# EAGLE design H32R10 (EAGLE 9.2.2)
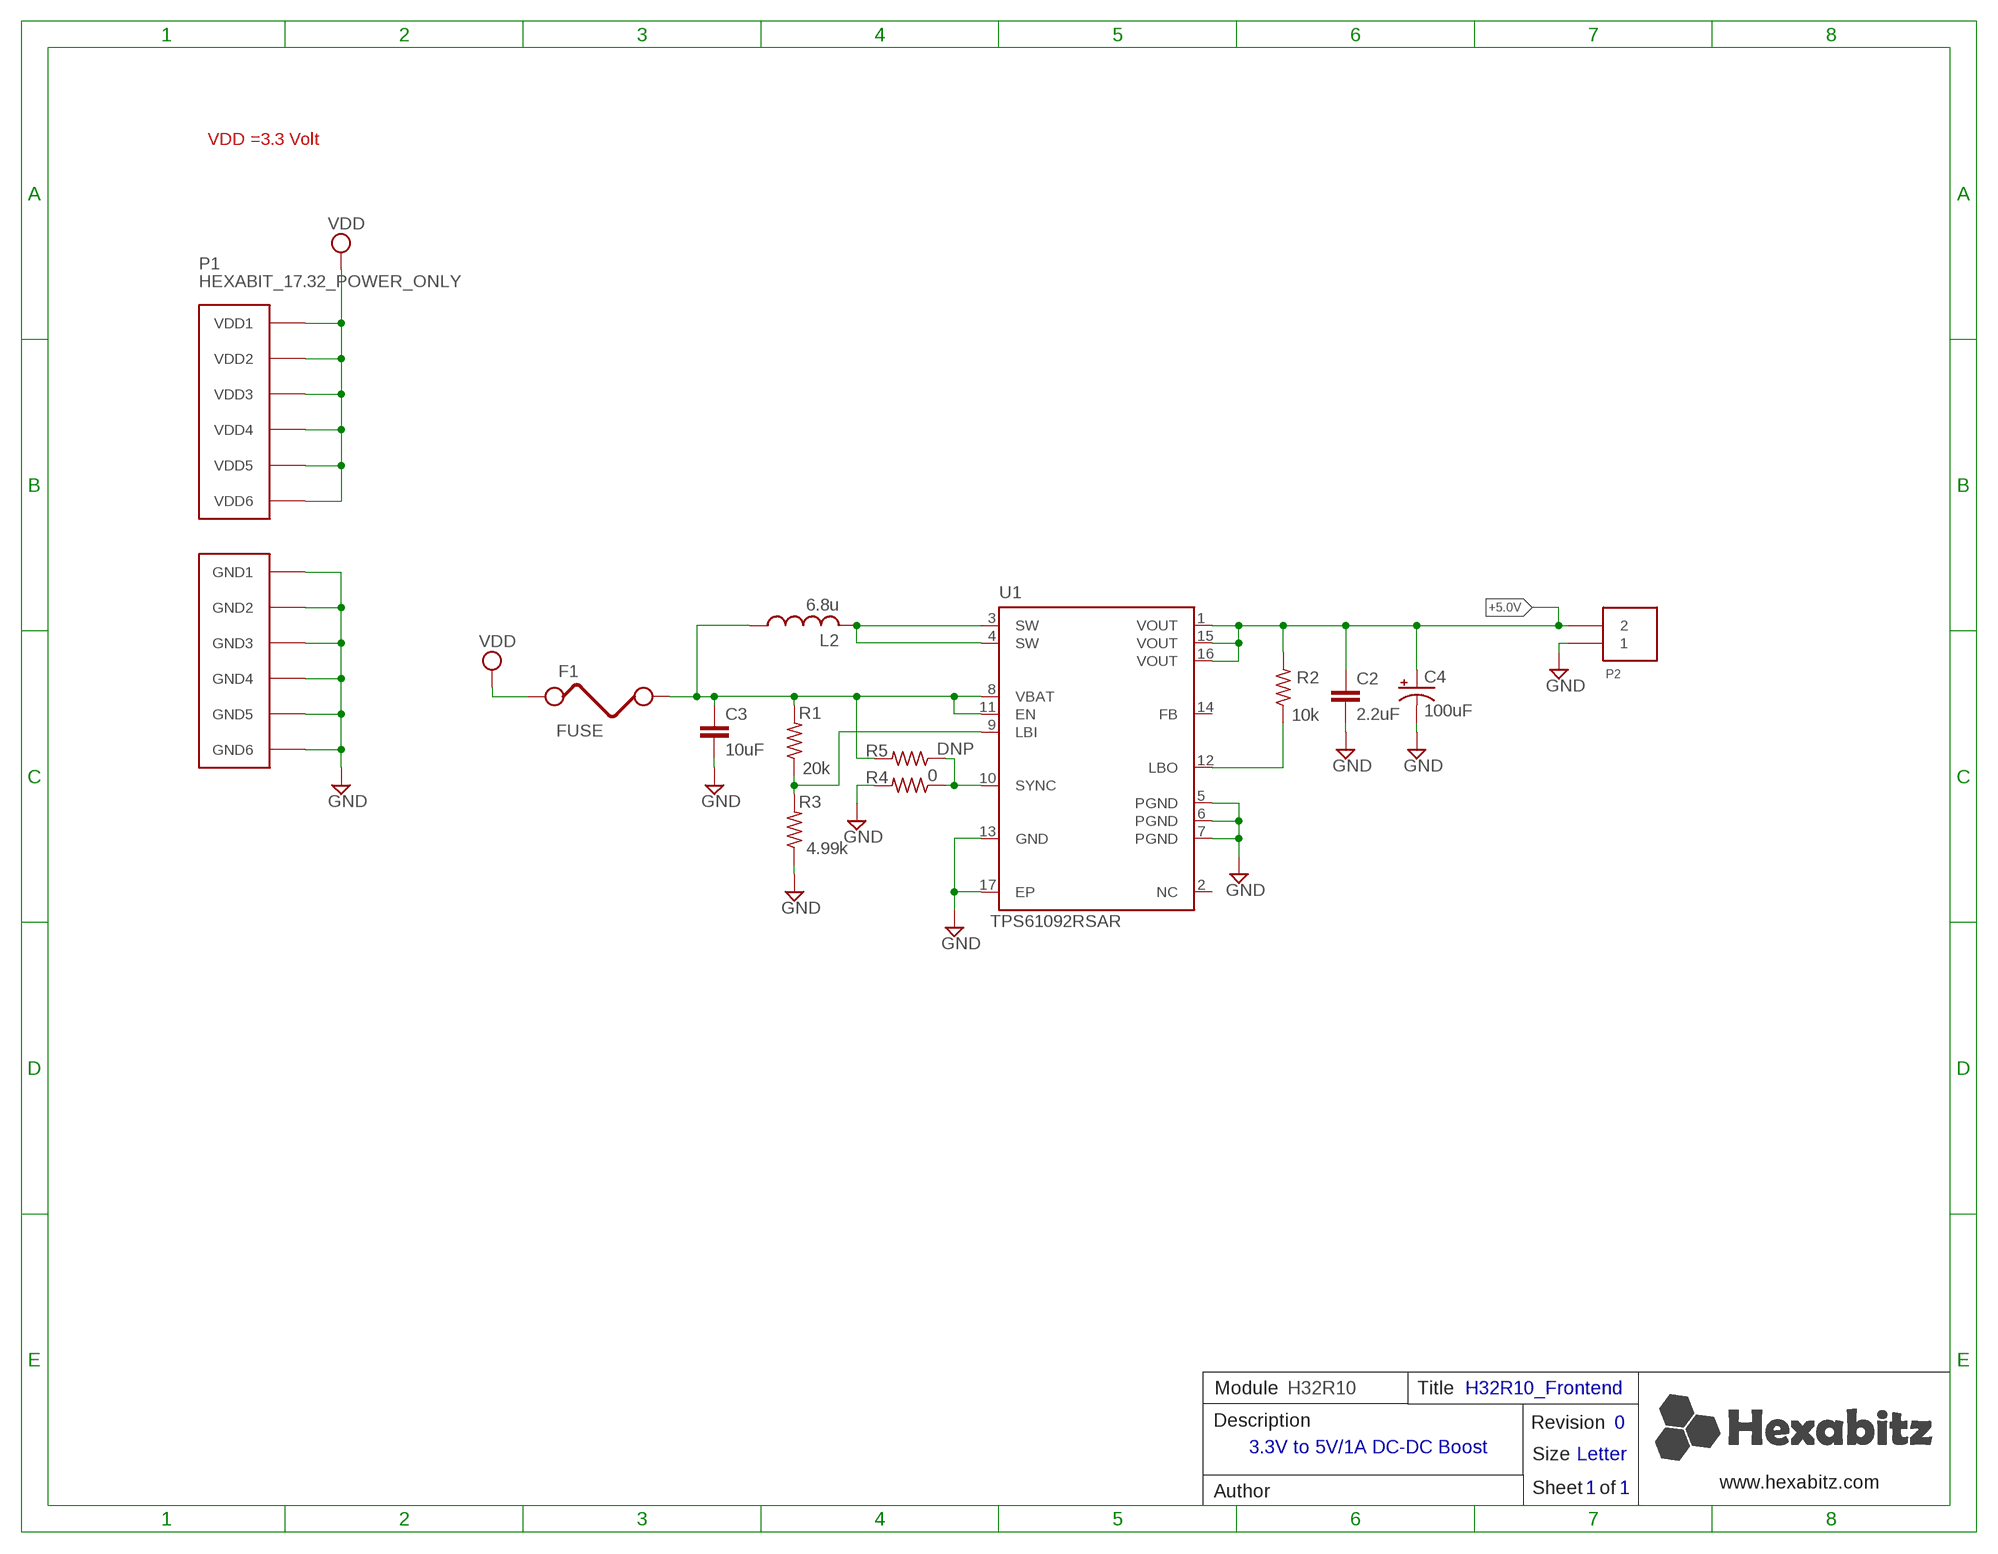
[diagram p0: schematic, sheet 1]

## Parts
C2  2.2uF  C-0603  [C-0603]
C3  10uF  C-0603  [C-0603]
C4  100uF  C-1210-POL  [C-1210-POL]
F1  FUSE  [FUSE]
L2  6.8u  IND-7447789006  [IND-7447789006]
P1  HEXABIT_17.32_POWER_ONLY  [HEXABIT_17.32_POWER_ONLY]
P2  691311500102  [691311500102]
R1  20k  R-0402  [R-0402]
R2  10k  R-0402  [R-0402]
R3  4.99k  R-0402  [R-0402]
R4  0  R-0402  [R-0402]
R5  DNP  R-0402  [R-0402]
U1  TPS61092RSAR  [TPS61092RSAR]

## Nets
+5.0V: C2.1 C4.1(+) P2.2 R2.2 U1.1(VOUT) U1.15(VOUT) U1.16(VOUT)
GND: C2.2 C3.2 C4.2(-) P1.PAD_PD7(GND1) P1.PAD_PD8(GND2) P1.PAD_PD9(GND3) P1.PAD_PD10(GND4) P1.PAD_PD11(GND5) P1.PAD_PD12(GND6) P2.1 R3.1 R4.2 U1.5(PGND) U1.6(PGND) U1.7(PGND) U1.13(GND) U1.17(EP)
N$1: R1.1 R3.2 U1.9(LBI)
N$2: C3.1 F1.2 L2.1 R1.2 R5.2 U1.8(VBAT) U1.11(EN)
N$3: L2.2 U1.3(SW) U1.4(SW)
N$4: R2.1 U1.12(LBO)
N$5: R4.1 R5.1 U1.10(SYNC)
VDD: F1.1 P1.PAD_PU7(VDD1) P1.PAD_PU8(VDD2) P1.PAD_PU9(VDD3) P1.PAD_PU10(VDD4) P1.PAD_PU11(VDD5) P1.PAD_PU12(VDD6)
Unconnected: U1.2(NC) U1.14(FB)

## Notes on the sheet
- VDD =3.3 Volt
- Module | H32R10 | Title | H32R10_Frontend
- Description | Revision | 0
- 3.3V to 5V/1A DC-DC Boost
- Size | Letter
- www.hexabitz.com
- Author | Sheet   of | 1 | 1
- C:/Users/Admin/Desktop/logodraft.bmp

## Library data of the parts
C2 = Hexabitz:C-0603: CAP CER 10% X7R 0603; CAPACITANCE: 2.2uF; MFN: TDK Corporation; MPN: C1608X5R1C225K080AB; OCTOPART_URL: https://octopart.com/search?q=C1608X5R1C225K080AB&start=0; TOLERANCE: ±10%; VOLTAGE_RATING: 16V
C3 = Hexabitz:C-0603: CAP CER 10% X7R 0603; CAPACITANCE: 10uF; MFN: Murata; MPN: GRM188R60J106ME84D; OCTOPART_URL: https://octopart.com/search?r=sp&s=3UultoWHTYKlRdSTI8cSeA&q=GRM188R60J106ME84&start=0; TOLERANCE: ±20%; VOLTAGE_RATING: 6.3V
C4 = Hexabitz:C-1210-POL: Cap Tant Solid SMD 1210; CAPACITANCE: 100uF; MFN: Taiyo Yuden; MPN: LMK325ABJ107MMHT; OCTOPART_URL: https://octopart.com/search?q=LMK325ABJ107MMHT&start=0
F1 = Hexabitz:FUSE: PTC RESET FUSE 16V 2.6A 1812; MFN: Littelfuse Inc.; MPN: MINISMDC260F/16-2; OCTOPART_URL: https://octopart.com/search?r=sp&s=3UultoWHTYKlRdSTI8cSeA&q=MINISMDC260F%2F16-2&start=0
L2 = Hexabitz:IND-7447789006: FIXED IND 6.8UH 2.5A 44 MOHM SMD; MFN: Wurth Electronics Inc.; MPN: 7447789006; OCTOPART_URL: https://octopart.com/search?q=7447789006&start=0
P1 = hexabitz_connectors:HEXABIT_?_POWER_ONLY: Hexabitz Hexagon Module Connector Hexagon side length = 17.32mm. Power-only connector. All array ports are removed.
P2 = Hexabitz:691311500102: Description : Pin header, straight Series WR-TBL / 311 Solder Pin [PCB, Through-Hole] 2P; MFN: 691311500102; MPN: Wurth Electronics Inc.; OCTOPART_URL: https://octopart.com/search?q=691311500102&start=0
R1 = Hexabitz:R-0402: Thick Film Resistors - SMD 0603; MFN: Yageo; MPN: RC0402FR-0720KL; OCTOPART_URL: https://octopart.com/search?q=%09%20RC0402FR-0720KL&start=0; RESISTANCE: 20K; TOLERANCE: 1%
R2 = Hexabitz:R-0402: Thick Film Resistors - SMD 0603; MFN: Yageo; MPN: AT0402FRE0710KL; OCTOPART_URL: https://octopart.com/search?q=AT0402FRE0710KL&start=0; RESISTANCE: 10K; TOLERANCE: 1%
R3 = Hexabitz:R-0402: Thick Film Resistors - SMD 0603; MFN: Yageo; MPN: AC0402FR-074K99L; OCTOPART_URL: https://octopart.com/search?q=AC0402FR-074K99L&start=0; RESISTANCE: 4.99K; TOLERANCE: 1%
R4 = Hexabitz:R-0402: Thick Film Resistors - SMD 0603; MFN: Yageo; MPN: AC0402JR-070RL; OCTOPART_URL: https://octopart.com/search?q=AC0402JR-070RL&start=0; RESISTANCE: 0
R5 = Hexabitz:R-0402: Thick Film Resistors - SMD 0603; MPN: DNP
U1 = Hexabitz:TPS61092RSAR: IC REG BOOST 5V 2A SYNC 16VQFN; MFN: Texas Instruments; MPN: TPS61092RSAR; OCTOPART_URL: https://octopart.com/tps61092rsar-texas+instruments-439857?r=sp&s=ulIrj1fsS3KVIo6pbpFvxA

## Board
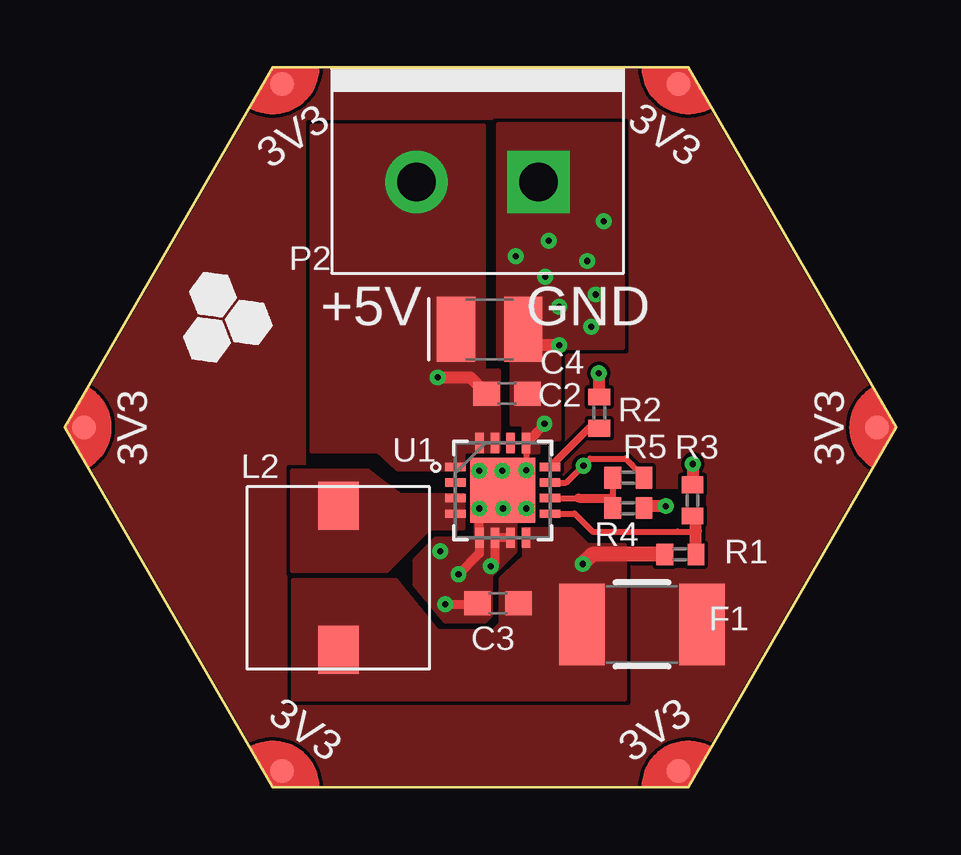
[diagram p1: board, top side]
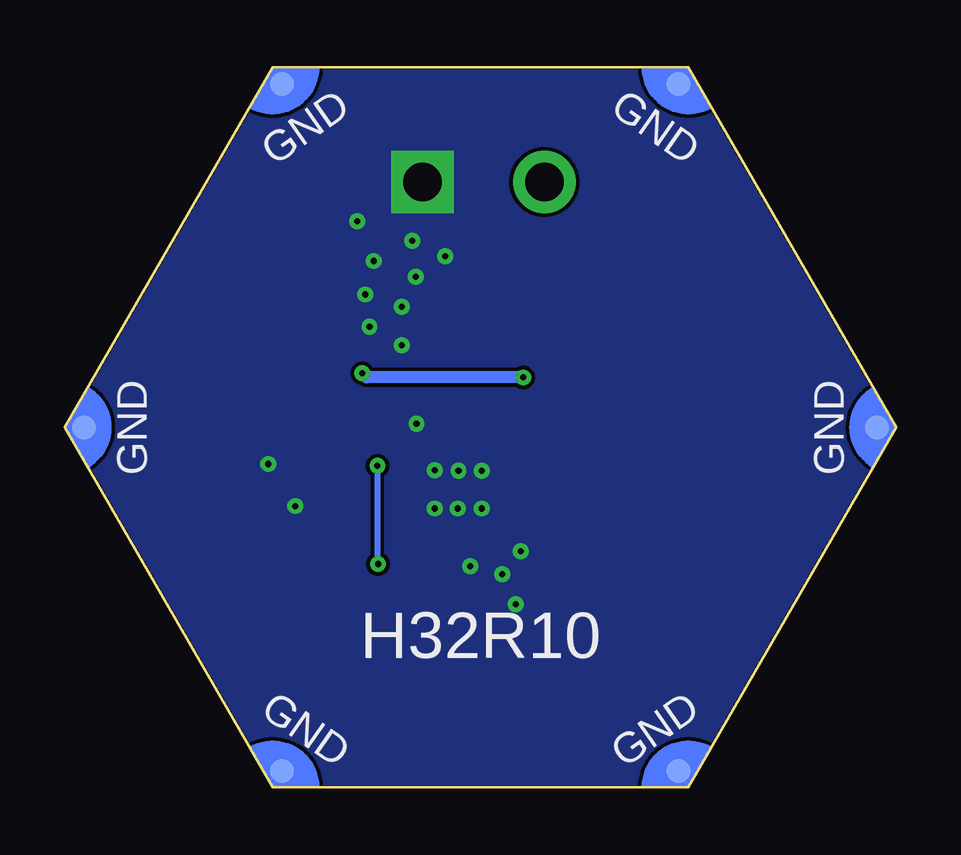
[diagram p2: board, bottom side, seen from below]

Size 34.64 x 30 mm. Coordinates in mm from the lower left corner, seen from the top.
Copper layers (1*16): Top 0.035mm / dielectric 1.5mm / Bottom 0.035mm
Design rules "2_layer *": minimum track width 7mil, minimum drill 10mil, track to track 6mil, track to pad 6mil, pad to pad 6mil, via to via 6mil, smd to smd 0mil, copper to edge 1mil, drill to drill 8mil, minimum pad ring 10mil, minimum via ring 8mil, stop-mask expansion 2mil, vias tented up to drill 15mil, thermal gap 10mil
tRestrict: area 25.2,9.2 to 26,10.1; area 23.1,11 to 24,12.6; area 24.5,11.6 to 26.6,12.4; area 10.1,13.4 to 10.6,13.8; area 17.6,27.2 to 17.9,27.8

### Footprints (pad centres in the part's own frame; a part is rotated, then mirrored left to right if it is on the bottom)
C-0603 = smd 1.1 x 1: 1 -0.85,0; 2 0.85,0
C-1210-POL = smd 1.6 x 2.7: 1 -1.4,0; 2 1.4,0
FUSE = smd 1.9 x 3.4: 1 -2.5,0; 2 2.5,0
IND-7447789006 = smd 1.7 x 2: 1 0,3; 2 0,-3
HEXABIT_17.32_POWER_ONLY = smd 1 x 1 bottom: PAD_PD7 8.26,14.31; PAD_PD8 16.52,0; PAD_PD9 8.26,-14.31; PAD_PD10 -8.26,-14.31; PAD_PD11 -16.52,0; PAD_PD12 -8.26,14.31 | smd 1 x 1: PAD_PU7 8.26,14.31; PAD_PU8 16.52,0; PAD_PU9 8.26,-14.31; PAD_PU10 -8.26,-14.31; PAD_PU11 -16.52,0; PAD_PU12 -8.26,14.31
691311500102 = drill 1.6 pad 2.6 square: 1 -2.54,0 | drill 1.6 pad 2.6: 2 2.54,0
R-0402 = smd 0.7 x 0.9: 1 -0.65,0; 2 0.65,0
TPS61092RSAR = smd 0.85 x 0.35: 1 -1.975,0.975; 2 -1.975,0.325; 3 -1.975,-0.325; 4 -1.975,-0.975; 9 1.975,-0.975; 10 1.975,-0.325; 11 1.975,0.325; 12 1.975,0.975 | smd 0.35 x 0.85: 5 -0.975,-1.975; 6 -0.325,-1.975; 7 0.325,-1.975; 8 0.975,-1.975; 13 0.975,1.975; 14 0.325,1.975; 15 -0.325,1.975; 16 -0.975,1.975 | smd 2.7 x 2.7: 17 0,0

### Placement (x,y rotation side)
C2  18.43,16.4 0 top
C3  18.05,7.68 180 top
C4  17.7,19.08 0 top
F1  24.05,6.79 180 top
L2  11.4,8.73 180 top
P1  17.32,15 0 top
P2  17.2,25.23 180 top
R1  25.65,9.71 180 top
R2  22.27,15.61 90 top
R3  26.16,11.96 270 top
R4  23.48,11.64 0 top
R5  23.48,12.9 0 top
U1  18.25,12.38 0 top

### Tracks (layer width: path | path; a pad name or v marks a point on that pad's centre or on a via)
+5.0V  (via drill 0.25 pad 0.51)
  Top 0.508: 22.1,16.26 R2.2 22.27,17.24 v22.25,17.26 | v15.54,17.08 16.89,17.08 C2.1
  Bottom 0.508: 15.54,17.11 v15.54,17.08 22.07,17.08 v22.25,17.26
  pour Top (no thermals): 13.87,13.25 16.61,13.25 16.61,13.98 16.63,14.01 18.03,14.01 18.08,14.06 18.08,17.36 17.45,17.36 17.45,27.57 10.28,27.57 10.28,14.01 13.05,14.01
GND  (via drill 0.25 pad 0.51)
  Top 0.254: U1.13 | U1.13 v19.22,13.22
  Top 0.381: U1.13 19.62,14.75 v19.99,15.15 | v17.75,9.21 17.92,9.38 U1.6 U1.7 | v16.41,8.88 17.27,9.75 U1.5 v17.27,11.62 | v15.85,7.63 17.15,7.63 C3.2
  Top 0.508: v20.6,18.43 19.76,18.43 C4.2 | v25.04,11.72 24.22,11.72 R4.2 | v26.16,13.48 R3.1
  other vias: 17.27,13.2 18.23,13.2 18.26,11.62 19.23,11.62 22.12,20.54 20.6,20.03 21.94,19.19 22.45,23.59 20.01,21.27 21.77,21.93 20.16,22.77 18.79,22.14 15.64,9.84
  pour Bottom (no thermals): 8.66,0 25.98,0 34.64,15 25.98,30 8.66,30 0,15
  pour Top (no thermals): 19.12,13.96 19.12,15.13 18.62,15.13 18.62,17.87 18.06,17.87 18.06,27.62 23.24,27.62 23.24,18.33 20.6,18.33 20.6,14.52 19.73,14.52 19.73,13.96
  pour Top (no thermals): 18.77,11.11 18.77,9.84 17.75,8.83 17.75,7.18 17.5,6.92 15.85,6.92 14.58,8.45 14.58,9.46 15.47,10.35 17.12,10.35 17.12,11.11
N$1
  Top 0.254: U1.9 21.25,11.4 21.99,10.66 25.52,10.66 26.27,10.66 26.3,10.68
  Top 0.508: R1.1 26.3,10.68 26.3,11.17 R3.2
N$2  (via drill 0.25 pad 0.51)
  Top 0.254: R5.2 23.62,13.45 23.36,13.7 21.89,13.7 | U1.11 20.89,12.7 21.89,13.7 | 21.89,13.7 21.89,13.68 v21.61,13.4
  Top 0.635: R1.2 21.99,9.71 v21.59,9.31
  Bottom 0.254: v21.61,13.4 21.61,9.34 v21.59,9.31
  pour Top (no thermals): 19.15,10.76 19.15,9.59 18.16,8.7 18.16,6.82 17.85,6.52 15.52,6.52 13.79,8.62 9.52,8.62 9.52,3.67 23.34,3.67 23.34,10.1 21.77,10.1 21.1,10.76
N$3
  pour Top (no thermals): 13.99,12.18 16.61,12.18 16.61,10.81 15.19,10.81 13.41,9.03 9.47,9.03 9.47,13.2 12.65,13.2 13.28,12.69
N$4
  Top 0.305: U1.12 21.83,14.96 R2.1
N$5
  Top 0.254: R5.1 22.83,11.95 R4.1 | U1.10 21.41,12.05
  Top 0.381: 21.41,12.05 22.73,12.05 22.83,11.95
VDD
  pour Top (rank 2, no thermals): 8.66,0 25.98,0 34.64,15 25.98,30 8.66,30 0,15

### Text on the board
tPlace: 3V3 | 3V3 | 3V3 | 3V3 | 3V3 | 3V3
bPlace: GND | GND | GND | GND | H32R10 | GND | GND
tNames: +5V | GND
LayerStack: Total Thickness 1.6 mm / --------------------------------------------------------- / / copper_top.gbr : Top Conductor - Copper: Thickness 0.035 mm / / Dielectric - FR-4: / / copper_bottom.gbr : Bottom Conductor - Copper: Thickness 0.035 mm